# EAGLE design hat (EAGLE 7.7.0)
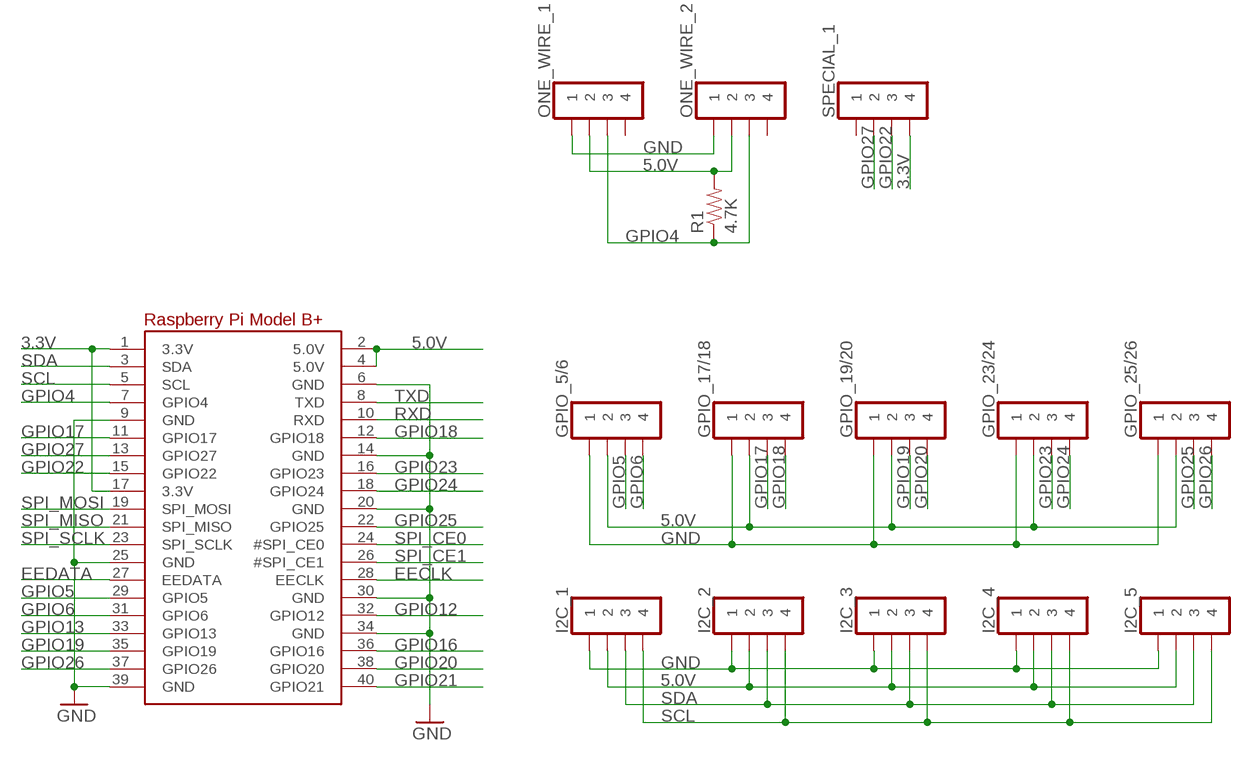
[diagram p0: schematic, sheet 1]

## Parts
GPIO_5/6  MOLEX_0705430003  [MOLEX_0705430003]
GPIO_17/18  MOLEX_0705430003  [MOLEX_0705430003]
GPIO_19/20  MOLEX_0705430003  [MOLEX_0705430003]
GPIO_23/24  MOLEX_0705430003  [MOLEX_0705430003]
GPIO_25/26  MOLEX_0705430003  [MOLEX_0705430003]
I2C_1  MOLEX_0705430003  [MOLEX_0705430003]
I2C_2  MOLEX_0705430003  [MOLEX_0705430003]
I2C_3  MOLEX_0705430003  [MOLEX_0705430003]
I2C_4  MOLEX_0705430003  [MOLEX_0705430003]
I2C_5  MOLEX_0705430003  [MOLEX_0705430003]
ONE_WIRE_1  MOLEX_0705430003  [MOLEX_0705430003]
ONE_WIRE_2  MOLEX_0705430003  [MOLEX_0705430003]
R1  4.7K  RESISTORPTH1  [AXIAL-0.3]
RPI1  RASPBERRYPI_BPLUS_HATNOSLOTS  [PI_HAT_NOSLOTS]
SPECIAL_1  MOLEX_0705430003  [MOLEX_0705430003]

## Nets
3.3V: RPI1.1(3.3V) RPI1.17(3.3V) SPECIAL_1.4
5.0V: GPIO_5/6.2 GPIO_17/18.2 GPIO_19/20.2 GPIO_23/24.2 GPIO_25/26.2 I2C_1.2 I2C_2.2 I2C_3.2 I2C_4.2 I2C_5.2 ONE_WIRE_1.2 ONE_WIRE_2.2 R1.P$2 RPI1.2(5.0V) RPI1.4(5.0V)
EECLK: RPI1.28(EECLK)
EEDATA: RPI1.27(EEDATA)
GND: GPIO_5/6.1 GPIO_17/18.1 GPIO_19/20.1 GPIO_23/24.1 GPIO_25/26.1 I2C_1.1 I2C_2.1 I2C_3.1 I2C_4.1 I2C_5.1 ONE_WIRE_1.1 ONE_WIRE_2.1 RPI1.6(GND) RPI1.9(GND) RPI1.14(GND) RPI1.20(GND) RPI1.25(GND) RPI1.30(GND) RPI1.34(GND) RPI1.39(GND)
GPIO4: ONE_WIRE_1.3 ONE_WIRE_2.3 R1.P$1 RPI1.7(GPIO4)
GPIO5: GPIO_5/6.3 RPI1.29(GPIO5)
GPIO6: GPIO_5/6.4 RPI1.31(GPIO6)
GPIO12: RPI1.32(GPIO12)
GPIO13: RPI1.33(GPIO13)
GPIO16: RPI1.36(GPIO16)
GPIO17: GPIO_17/18.3 RPI1.11(GPIO17)
GPIO18: GPIO_17/18.4 RPI1.12(GPIO18)
GPIO19: GPIO_19/20.3 RPI1.35(GPIO19)
GPIO20: GPIO_19/20.4 RPI1.38(GPIO20)
GPIO21: RPI1.40(GPIO21)
GPIO22: RPI1.15(GPIO22) SPECIAL_1.3
GPIO23: GPIO_23/24.3 RPI1.16(GPIO23)
GPIO24: GPIO_23/24.4 RPI1.18(GPIO24)
GPIO25: GPIO_25/26.3 RPI1.22(GPIO25)
GPIO26: GPIO_25/26.4 RPI1.37(GPIO26)
GPIO27: RPI1.13(GPIO27) SPECIAL_1.2
RXD: RPI1.10(RXD)
SCL: I2C_1.4 I2C_2.4 I2C_3.4 I2C_4.4 I2C_5.4 RPI1.5(SCL)
SDA: I2C_1.3 I2C_2.3 I2C_3.3 I2C_4.3 I2C_5.3 RPI1.3(SDA)
SPI_CE0: RPI1.24(#SPI_CE0)
SPI_CE1: RPI1.26(#SPI_CE1)
SPI_MISO: RPI1.21(SPI_MISO)
SPI_MOSI: RPI1.19(SPI_MOSI)
SPI_SCLK: RPI1.23(SPI_SCLK)
TXD: RPI1.8(TXD)
Unconnected: ONE_WIRE_1.4 ONE_WIRE_2.4 SPECIAL_1.1

## Library data of the parts
GPIO_5/6 GPIO_17/18 GPIO_19/20 GPIO_23/24 GPIO_25/26 I2C_1-I2C_5 ONE_WIRE_1 ONE_WIRE_2 SPECIAL_1 = REM_Connectors_Molex:MOLEX_0705430003: Male Header, 4 positions, shrouded with latch slot, 100-mil pitch, through-hole mounted, gold plated pins
R1 = SparkFun:RESISTOR: Resistor Basic schematic elements and footprints for 0603, 1206, and PTH 1/10th watt (small) resistors.
RPI1 = microbuilder:RASPBERRYPI_BPLUS

## Board
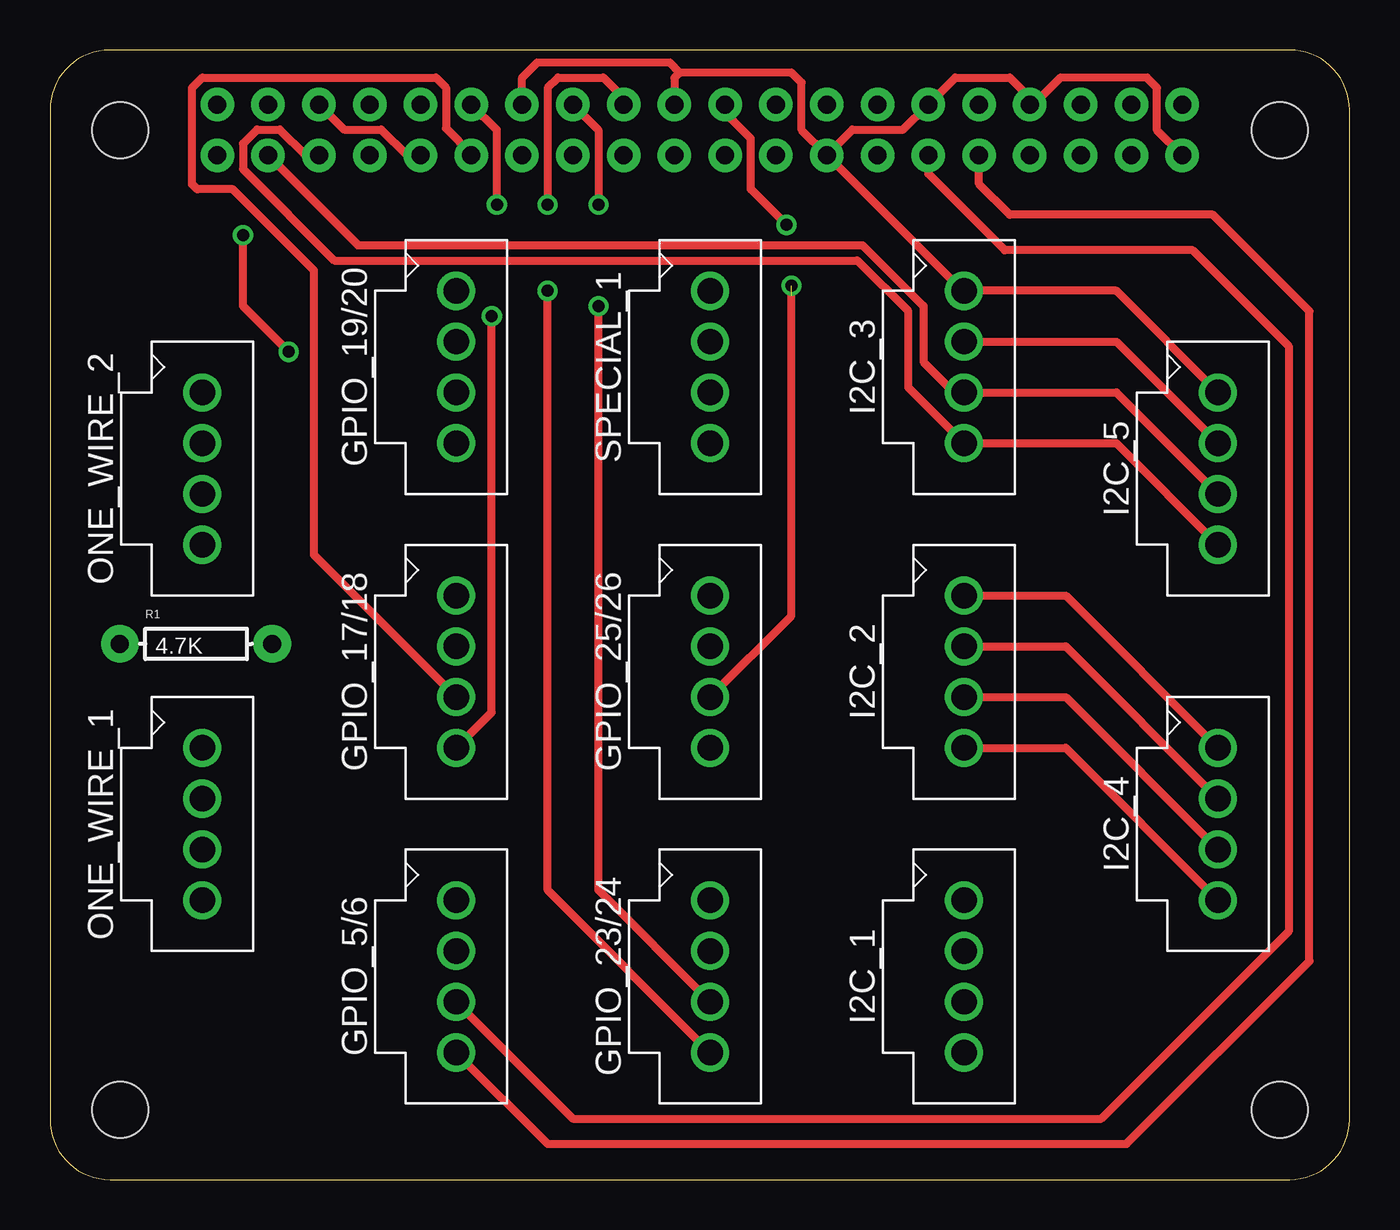
[diagram p1: board, top side]
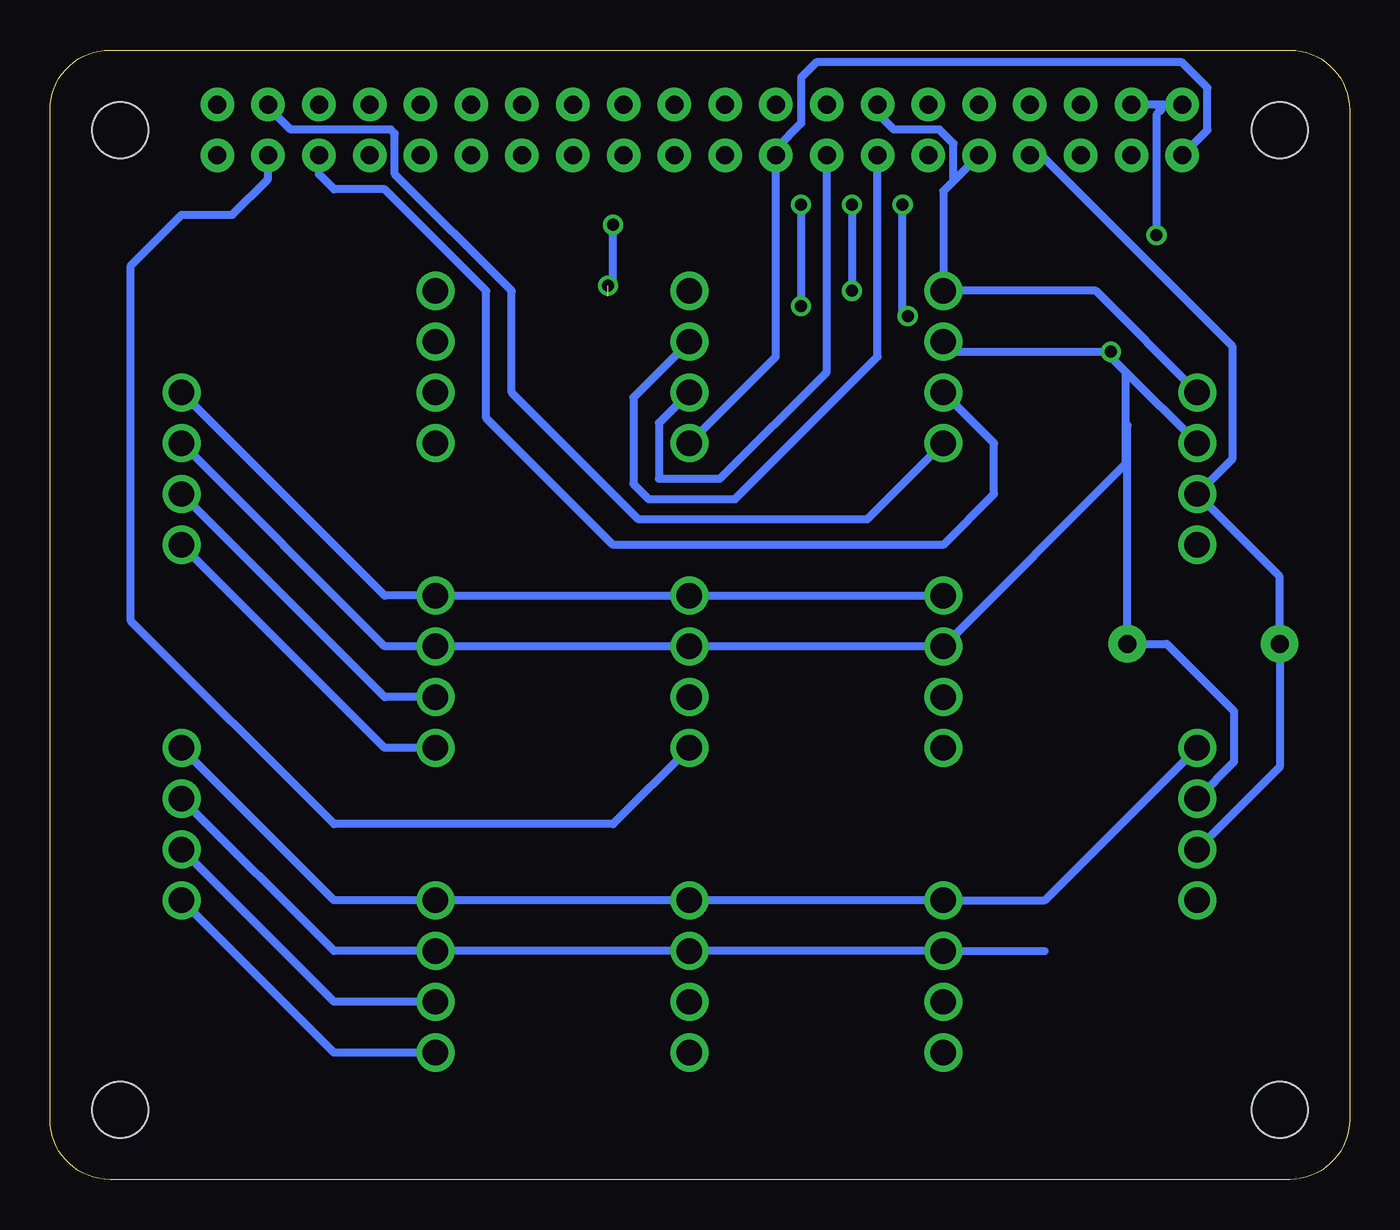
[diagram p2: board, bottom side, seen from below]

Size 65 x 56.5 mm. Coordinates in mm from the lower left corner, seen from the top.
Copper layers (1*16): Top 0.035mm / dielectric 1.5mm / Bottom 0.035mm
Design rules "adafruit *": minimum track width 8mil, minimum drill 15.5mil, track to track 8mil, track to pad 8mil, pad to pad 8mil, via to via 8mil, smd to smd 8mil, copper to edge 10mil, drill to drill 8mil, minimum pad ring 10mil, minimum via ring 8mil, stop-mask expansion 2mil, vias tented up to drill 20mil, thermal gap 10mil

### Footprints (pad centres in the part's own frame; a part is rotated, then mirrored left to right if it is on the bottom)
MOLEX_0705430003 = drill 1.27 pad 1.778: 1 3.81,0; 2 1.27,0; 3 -1.27,0; 4 -3.81,0
AXIAL-0.3 = drill 0.9 pad 1.88: P$1 -3.81,0; P$2 3.81,0
PI_HAT_NOSLOTS = drill 0.9 pad 1.676: 1 8.37,51.23; 2 8.37,53.77; 3 10.91,51.23; 4 10.91,53.77; 5 13.45,51.23; 6 13.45,53.77; 7 15.99,51.23; 8 15.99,53.77; 9 18.53,51.23; 10 18.53,53.77; 11 21.07,51.23; 12 21.07,53.77; 13 23.61,51.23; 14 23.61,53.77; 15 26.15,51.23; 16 26.15,53.77; 17 28.69,51.23; 18 28.69,53.77; 19 31.23,51.23; 20 31.23,53.77; 21 33.77,51.23; 22 33.77,53.77; 23 36.31,51.23; 24 36.31,53.77; 25 38.85,51.23; 26 38.85,53.77; 27 41.39,51.23; 28 41.39,53.77; 29 43.93,51.23; 30 43.93,53.77; 31 46.47,51.23; 32 46.47,53.77; 33 49.01,51.23; 34 49.01,53.77; 35 51.55,51.23; 36 51.55,53.77; 37 54.09,51.23; 38 54.09,53.77; 39 56.63,51.23; 40 56.63,53.77 | hole 2.8: 3.5,3.5; 3.5,52.5; 61.5,52.5; 61.5,3.5

### Placement (x,y rotation side)
GPIO_5/6  20.32,10.16 90 top
GPIO_17/18  20.32,25.4 90 top
GPIO_19/20  20.32,40.64 90 top
GPIO_23/24  33.02,10.16 90 top
GPIO_25/26  33.02,25.4 90 top
I2C_1  45.72,10.16 90 top
I2C_2  45.72,25.4 90 top
I2C_3  45.72,40.64 90 top
I2C_4  58.42,17.78 90 top
I2C_5  58.42,35.56 90 top
ONE_WIRE_1  7.62,17.78 90 top
ONE_WIRE_2  7.62,35.56 90 top
R1  7.3,26.8 0 top
RPI1  0,0 0 top
SPECIAL_1  33.02,40.64 90 top

### Tracks (layer width: path | path; a pad name or v marks a point on that pad's centre or on a via)
3.3V
  Bottom 0.406: SPECIAL_1.4 28.69,41.16 RPI1.17 28.69,51.57 27.43,52.83 27.43,55.12 26.67,55.88 8.38,55.88 7.11,54.61 7.11,52.49 RPI1.1
5.0V  (via drill 0.6)
  Top 0.406: I2C_2.2 50.8,26.67 I2C_4.2 | I2C_3.2 53.34,41.91 I2C_5.2 | v11.94,41.4 9.65,43.69 v9.65,47.24
  Bottom 0.406: I2C_4.2 50.8,11.43 I2C_1.2 GPIO_23/24.2 GPIO_5/6.2 15.24,11.43 | I2C_5.2 48.26,26.67 I2C_2.2 GPIO_25/26.2 GPIO_17/18.2 11.18,35.81 11.18,37.78 | ONE_WIRE_2.2 11.18,40.39 | 11.18,37.78 11.18,40.39 | RPI1.2 9.65,53.77 | 9.65,53.77 RPI1.4 | 9.65,53.77 9.4,53.52 9.65,53.26 v9.65,47.24 | 11.18,40.39 11.94,41.15 v11.94,41.4 19.81,41.4 GPIO_19/20.2 | ONE_WIRE_1.2 5.78,20.89 5.78,23.43 9.14,26.8 R1.P$2 11.11,37.72 11.18,37.78
GND
  Top 0.406: I2C_2.1 50.8,29.21 I2C_4.1 | I2C_5.1 53.34,44.45 I2C_3.1 45.63,44.45 RPI1.25 | 43.86,53.77 RPI1.30 | RPI1.30 45.28,55.12 48.01,55.12 49.01,54.11 RPI1.34 49.2,53.77 50.55,55.12 54.86,55.12 55.37,54.61 55.37,52.49 RPI1.39 | 18.53,51.32 RPI1.9 17.86,51.23 16.57,52.51 14.71,52.51 RPI1.6 | RPI1.25 37.59,52.49 37.59,54.86 37.08,55.37 31.5,55.37 | 31.5,55.37 31.23,55.11 RPI1.20 | RPI1.14 23.62,53.78 23.62,55.12 24.38,55.88 30.99,55.88 31.5,55.37 | RPI1.25 40.13,52.51 42.67,52.51 RPI1.30
  Bottom 0.406: I2C_4.1 50.8,13.97 I2C_1.1 GPIO_23/24.1 GPIO_5/6.1 15.24,13.97 ONE_WIRE_1.1 | I2C_5.1 48.26,29.21 I2C_2.1 GPIO_25/26.1 GPIO_17/18.1 | ONE_WIRE_2.1 12.7,44.45 GPIO_19/20.1 20.32,49.44 19.81,49.95 | RPI1.9 19.81,49.95 | 19.81,49.95 19.81,51.82 20.51,52.51 22.8,52.51 23.61,53.33 RPI1.14
GPIO4
  Bottom 0.406: RPI1.7 15.42,51.23 5.84,41.66 5.84,36.07 ONE_WIRE_2.3 3.49,30.16 R1.P$1 3.49,20.64 ONE_WIRE_1.3
GPIO5
  Top 0.406: GPIO_5/6.3 26.16,3.05 52.58,3.05 61.98,12.45 61.98,41.66 57.15,46.48 47.75,46.48 43.93,50.3 RPI1.29
GPIO6
  Top 0.406: GPIO_5/6.4 24.89,1.78 53.85,1.78 62.99,10.92 62.99,43.43 58.17,48.26 48.01,48.26 46.47,49.8 RPI1.31
GPIO17
  Top 0.406: GPIO_17/18.3 13.21,31.24 13.21,45.47 9.14,49.53 7.37,49.53 7.11,49.78 7.11,54.61 7.62,55.12 19.3,55.12 19.81,54.61 19.81,52.58 21.07,51.32 RPI1.11
GPIO18  (via drill 0.6)
  Top 0.406: RPI1.12 22.35,52.49 v22.35,48.77 | v22.1,43.18 22.1,23.37 GPIO_17/18.4
  Bottom 0.406: v22.1,43.18 22.35,43.43 v22.35,48.77
GPIO19
  Bottom 0.406: GPIO_19/20.3 17.78,36.83 17.78,34.29 20.32,31.75 36.83,31.75 43.18,38.1 43.18,44.45 48.26,49.53 50.8,49.53 51.55,50.28 RPI1.35
GPIO20
  Bottom 0.406: 54.09,53.58 RPI1.38 54.09,53.65 52.96,52.51 47.94,52.51 47.75,52.32 47.75,50.29 41.91,44.45 41.91,39.37 35.56,33.02 24.13,33.02 GPIO_19/20.4
GPIO22
  Bottom 0.406: SPECIAL_1.3 34.54,37.85 34.54,35.05 31.5,35.05 26.15,40.4 RPI1.15
GPIO23  (via drill 0.6)
  Top 0.406: RPI1.16 27.43,52.49 v27.43,48.77 | GPIO_23/24.3 27.43,14.48 v27.43,43.69
  Bottom 0.406: v27.43,48.77 v27.43,43.69
GPIO24  (via drill 0.6)
  Top 0.406: GPIO_23/24.4 24.89,14.48 v24.89,44.45 | RPI1.18 28.69,54.11 27.69,55.12 25.4,55.12 24.89,54.61 v24.89,48.77
  Bottom 0.406: v24.89,48.77 v24.89,44.45
GPIO25  (via drill 0.6)  (1 unrouted)
  Top 0.406: GPIO_25/26.3 37.08,28.19 37.08,44.2 | v36.83,47.75 35.05,49.53 35.05,52.07 33.77,53.35 RPI1.22
  Bottom 0.406: v37.08,44.7 36.83,44.96 v36.83,47.75
GPIO26
  Bottom 0.406: GPIO_25/26.4 36.83,17.78 50.8,17.78 60.96,27.94 60.96,45.72 58.42,48.26 55.88,48.26 54.09,50.05 RPI1.37
GPIO27
  Bottom 0.406: SPECIAL_1.2 35.81,39.12 35.81,34.8 35.05,34.04 30.73,34.04 23.61,41.16 RPI1.13
SCL
  Top 0.406: I2C_2.4 50.8,21.59 I2C_4.4 | I2C_5.4 53.34,36.83 I2C_3.4 42.93,39.62 42.93,43.43 40.39,45.97 14.22,45.97 9.65,50.55 9.65,51.82 10.35,52.51 11.49,52.51 12.78,51.23 RPI1.5
  Bottom 0.406: I2C_1.4 50.8,6.35 I2C_4.4 | I2C_2.4 48.26,21.59 I2C_5.4
SDA
  Top 0.406: I2C_2.3 50.8,24.13 I2C_4.3 | I2C_5.3 53.34,39.37 I2C_3.3 45.21,39.37 43.69,40.89 43.69,43.69 40.64,46.74 16,46.74 15.91,46.74 15.4,46.74 RPI1.3
  Bottom 0.406: I2C_1.3 50.8,8.89 I2C_4.3 | I2C_2.3 48.26,24.13 I2C_5.3